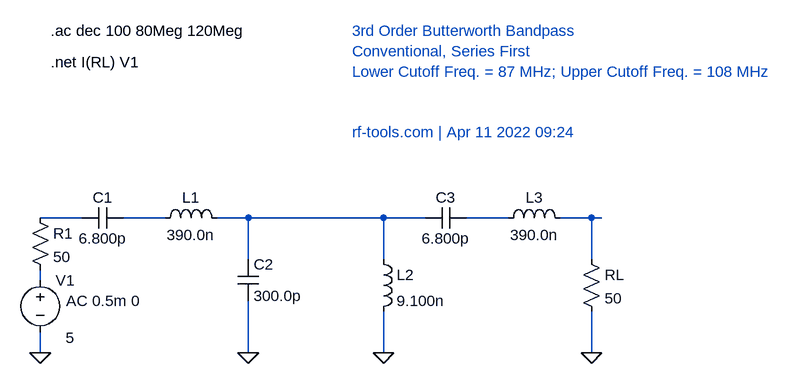
[diagram p0: schematic Butterworth Bandpass Filter.asc]
Butterworth Bandpass Filter.asc, the LTspice schematic file:
Version 4
SHEET 1 1200 400
WIRE 64 0 0 0
WIRE 192 0 128 0
WIRE 320 0 272 0
WIRE 528 0 320 0
WIRE 592 0 528 0
WIRE 720 0 656 0
WIRE 848 0 800 0
WIRE 864 0 848 0
WIRE 320 64 320 0
WIRE 528 64 528 0
WIRE 848 64 848 0
WIRE 0 96 0 80
WIRE 0 208 0 176
WIRE 320 208 320 128
WIRE 528 208 528 144
WIRE 848 208 848 144
FLAG 0 208 0
FLAG 320 208 0
FLAG 528 208 0
FLAG 848 208 0
SYMBOL voltage 0 80 R0
WINDOW 123 40 48 Left 2
WINDOW 39 39 77 Left 2
WINDOW 3 39 105 Left 2
SYMATTR Value2 AC 0.5m 0
SYMATTR InstName V1
SYMATTR Value 5
SYMBOL cap 64 16 R270
WINDOW 0 32 32 VTop 2
WINDOW 3 0 32 VBottom 2
SYMATTR InstName C1
SYMATTR Value 6.800p
SYMBOL ind 176 16 R270
WINDOW 0 32 56 VTop 2
WINDOW 3 5 56 VBottom 2
SYMATTR InstName L1
SYMATTR Value 390.0n
SYMBOL cap 304 64 R0
SYMATTR InstName C2
SYMATTR Value 300.0p
SYMBOL ind 512 48 R0
SYMATTR InstName L2
SYMATTR Value 9.100n
SYMBOL cap 592 16 R270
WINDOW 0 32 32 VTop 2
WINDOW 3 0 32 VBottom 2
SYMATTR InstName C3
SYMATTR Value 6.800p
SYMBOL ind 704 16 R270
WINDOW 0 32 56 VTop 2
WINDOW 3 5 56 VBottom 2
SYMATTR InstName L3
SYMATTR Value 390.0n
SYMBOL res 832 48 R0
SYMATTR InstName RL
SYMATTR Value 50
SYMBOL res -16 -16 R0
SYMATTR InstName R1
SYMATTR Value 50
TEXT 16 -288 Left 2 !.ac dec 100 80Meg 120Meg
TEXT 16 -240 Left 2 !.net I(RL) V1
TEXT 480 -288 Left 2 ;3rd Order Butterworth Bandpass\nConventional, Series First\nLower Cutoff Freq. = 87 MHz; Upper Cutoff Freq. = 108 MHz\n\n\nrf-tools.com | Apr 11 2022 09:24

The netlist it stands for:
* Butterworth Bandpass Filter.asc
V1 N006 0 5 AC 0.5m 0
C1 N001 N002 6.800p
L1 N002 N003 390.0n
C2 N003 0 300.0p
L2 N003 0 9.100n
C3 N003 N004 6.800p
L3 N004 N005 390.0n
RL N005 0 50
R1 N001 N006 50
.ac dec 100 80Meg 120Meg
.net I(RL) V1
* 3rd Order Butterworth Bandpass
* Conventional, Series First
* Lower Cutoff Freq. = 87 MHz; Upper Cutoff Freq. = 108 MHz
* rf-tools.com | Apr 11 2022 09:24
.backanno
.end